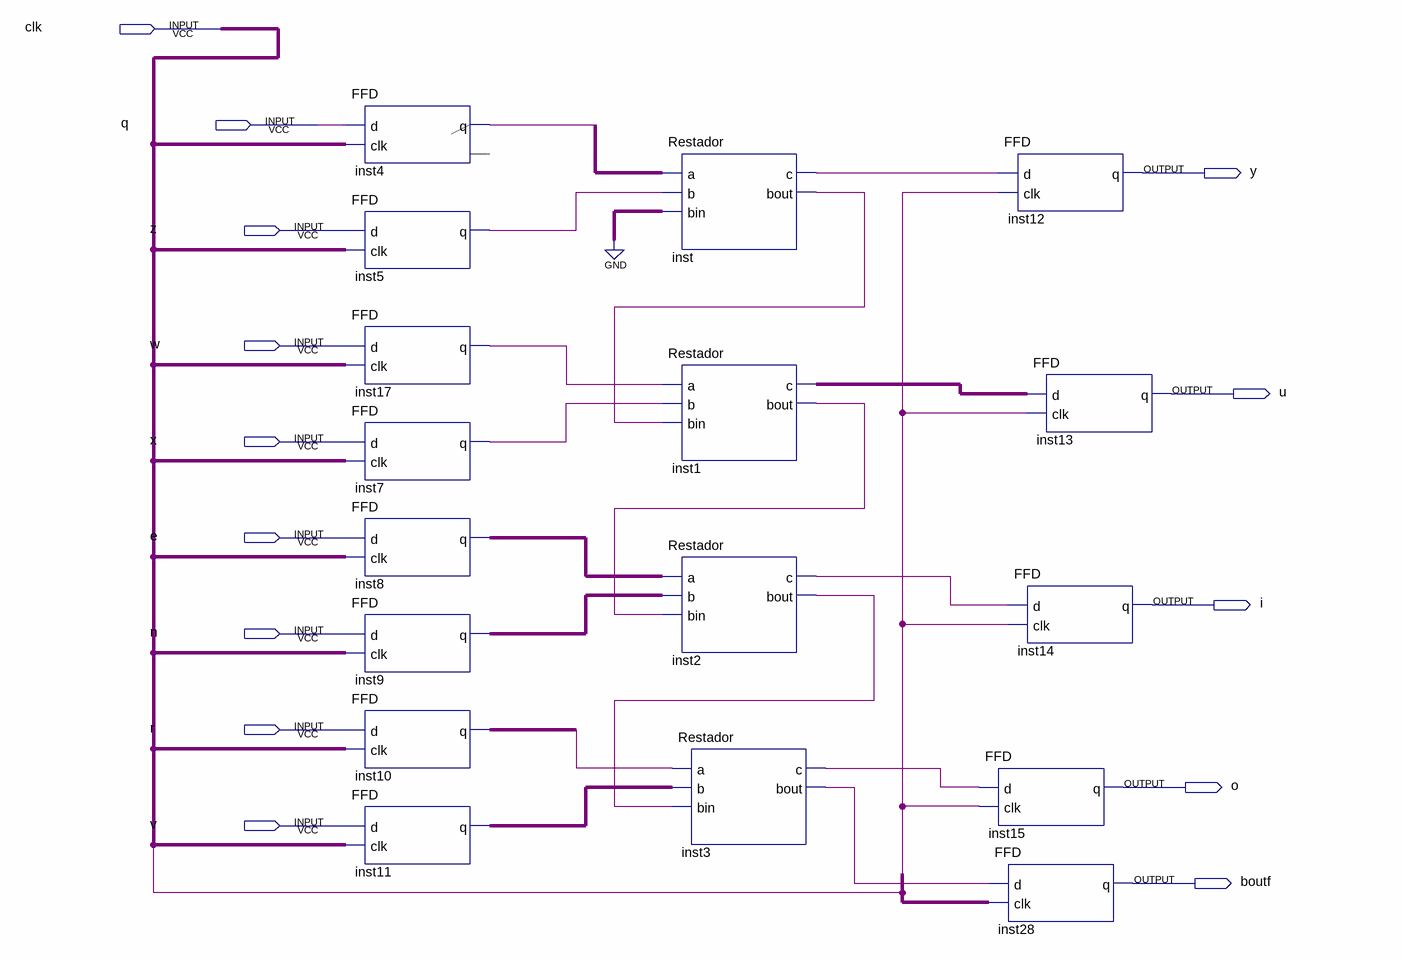
[diagram p0: schematic sheet]
// Quartus schematic Esquematicofourbitsr.bdf as structural Verilog: 17 symbols, 14 pins
module Esquematicofourbitsr (
  input  clk,
  input  q,
  input  z,
  input  w,
  input  x,
  input  e,
  input  n,
  input  r,
  input  v,
  output y,
  output u,
  output i,
  output o,
  output boutf
);

  wire inst1_bout, inst1_c, inst2_bout, inst2_c, inst3_bout, inst3_c, inst4_q, inst5_q, inst7_q, inst8_q,
       inst9_q, inst10_q, inst11_q, inst17_q, inst_bout, inst_c;

  FFD inst4 (.d(q), .clk(clk), .q(inst4_q));
  FFD inst5 (.d(z), .clk(clk), .q(inst5_q));
  FFD inst17 (.d(w), .clk(clk), .q(inst17_q));
  FFD inst7 (.d(x), .clk(clk), .q(inst7_q));
  FFD inst8 (.d(e), .clk(clk), .q(inst8_q));
  FFD inst9 (.d(n), .clk(clk), .q(inst9_q));
  FFD inst10 (.d(r), .clk(clk), .q(inst10_q));
  FFD inst11 (.d(v), .clk(clk), .q(inst11_q));
  Restador inst (.a(inst4_q), .b(inst5_q), .bin(1'b0), .c(inst_c), .bout(inst_bout));
  Restador inst1 (.a(inst17_q), .b(inst7_q), .bin(inst_bout), .c(inst1_c), .bout(inst1_bout));
  Restador inst2 (.a(inst8_q), .b(inst9_q), .bin(inst1_bout), .c(inst2_c), .bout(inst2_bout));
  Restador inst3 (.a(inst10_q), .b(inst11_q), .bin(inst2_bout), .c(inst3_c), .bout(inst3_bout));
  FFD inst15 (.d(inst3_c), .clk(clk), .q(o));
  FFD inst28 (.d(inst3_bout), .clk(clk), .q(boutf));
  FFD inst12 (.d(inst_c), .clk(clk), .q(y));
  FFD inst13 (.d(inst1_c), .clk(clk), .q(u));
  FFD inst14 (.d(inst2_c), .clk(clk), .q(i));
endmodule
